# Altium schematic sheet interface.SchDoc: Interface
size A3; Author: Francesco Sacchi <batt@develer.com>; Organization: Develer s.r.l.; Address1: via Mugellese 1/A; Address2: 50019 Campi Bisenzio; Address3: Firenze; Address4: ITALY; DocumentNumber: 1; Revision: 0; SheetNumber: 1; SheetTotal: 6
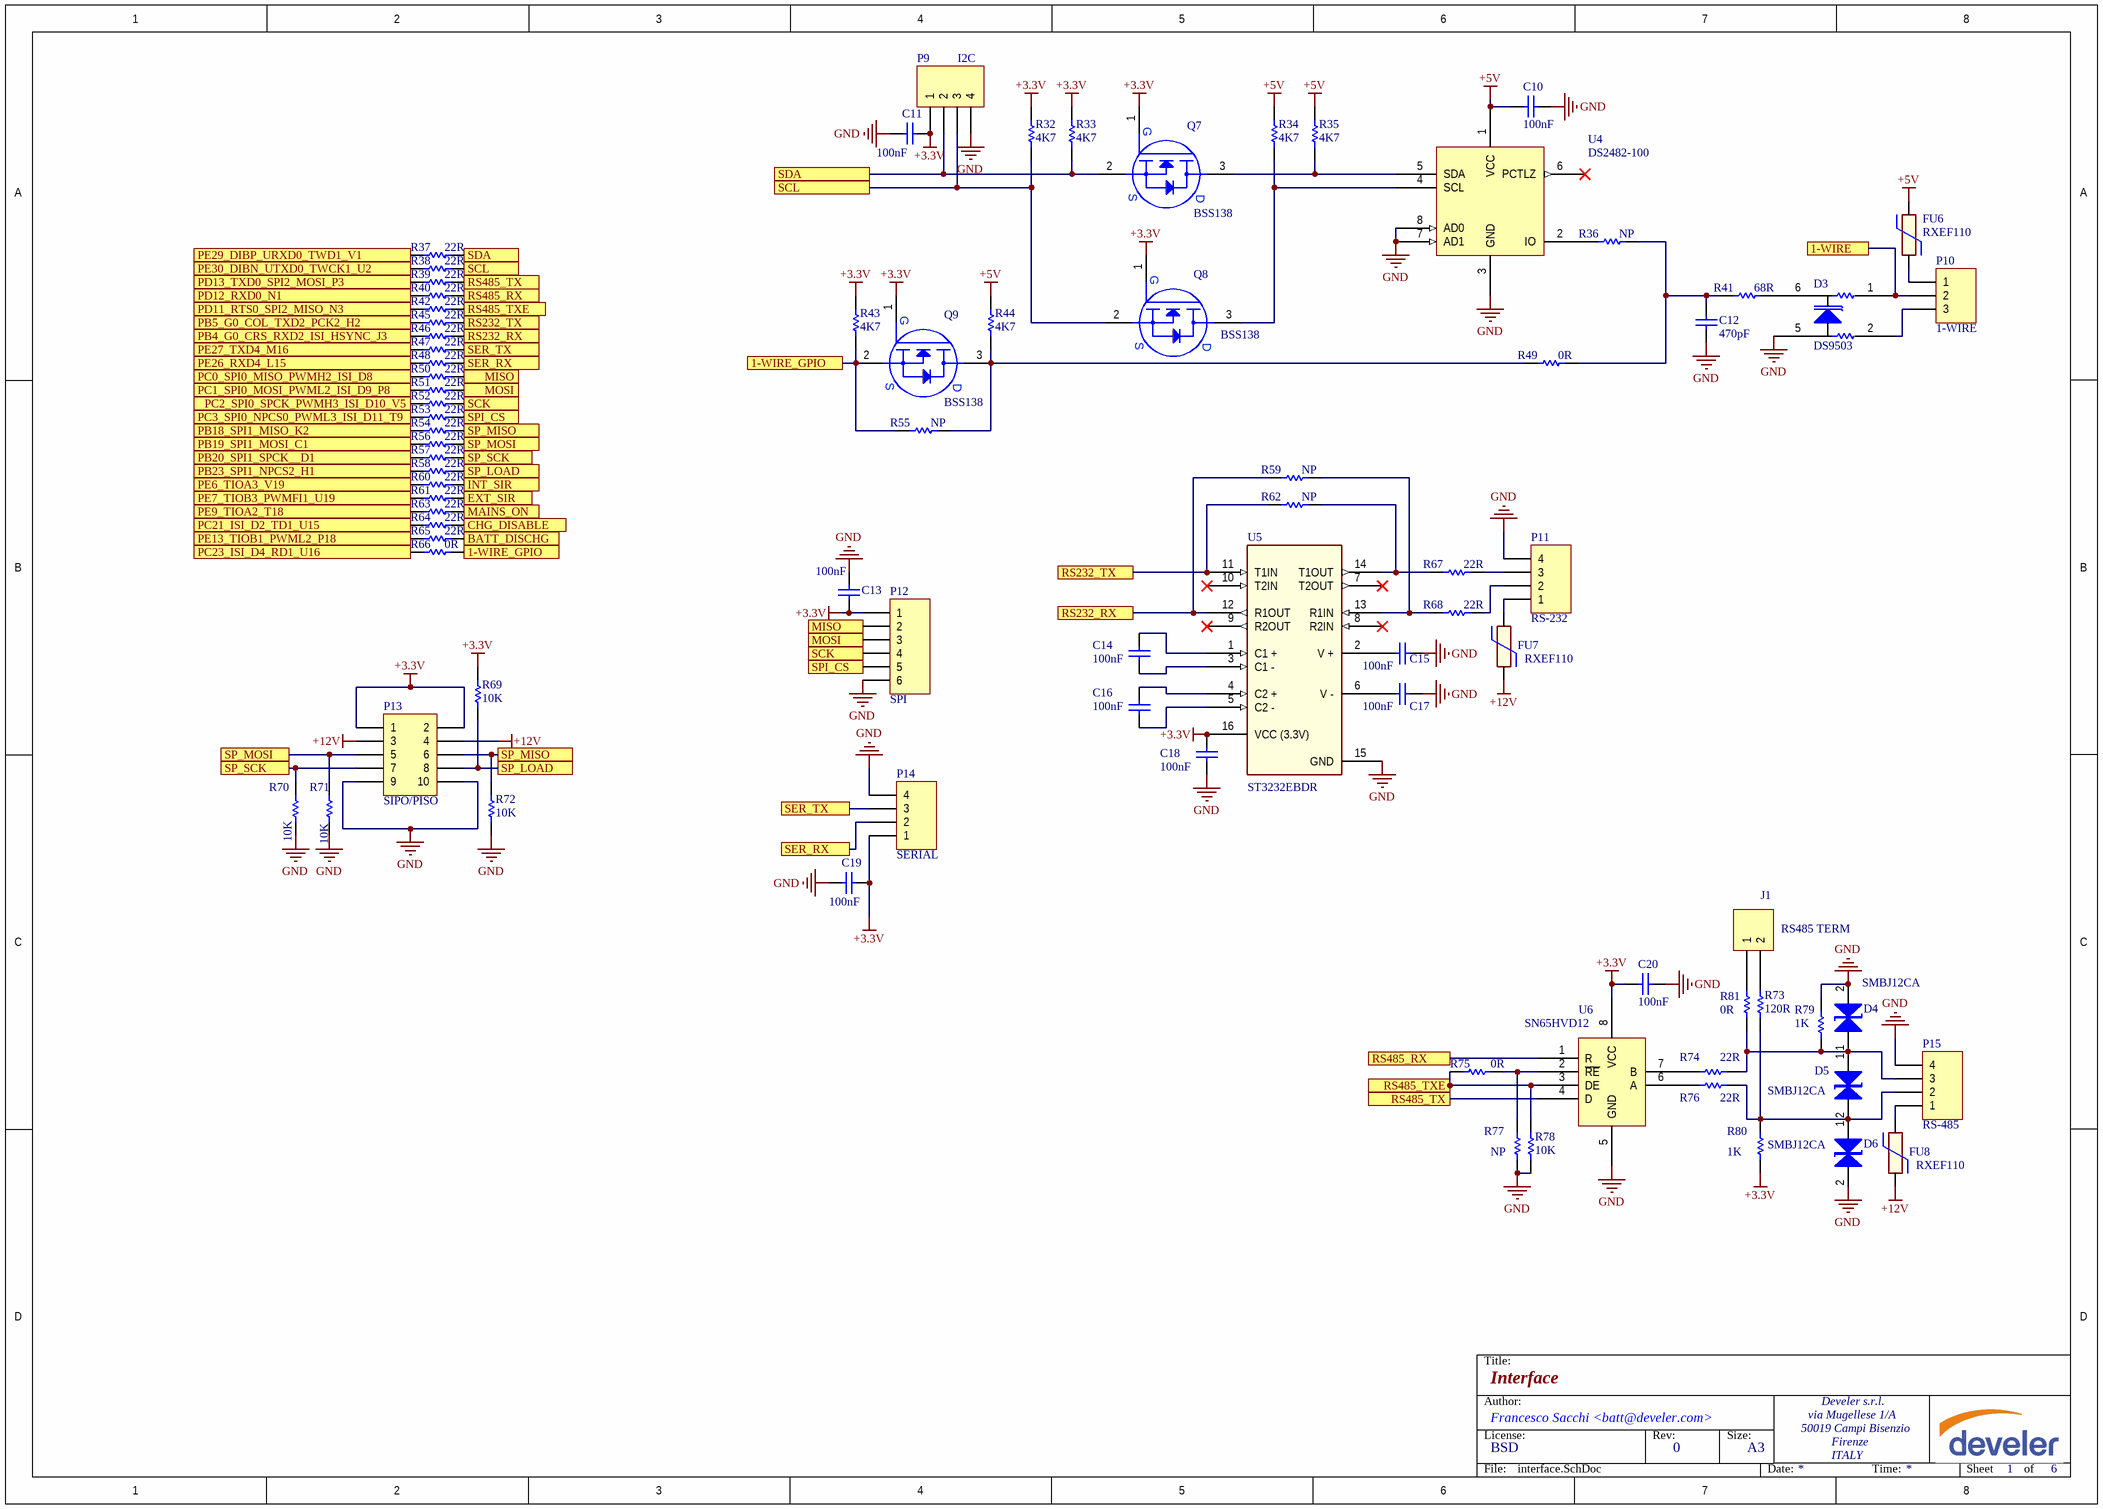
[diagram p0: interface.SchDoc]

## Parts
C10  100nF  [0603_[1608]]
C11  100nF  [0603_[1608]]
C12  470pF  [0603_[1608]]
C13  100nF  [0603_[1608]]
C14  100nF  [0603_[1608]]
C15  100nF  [0603_[1608]]
C16  100nF  [0603_[1608]]
C17  100nF  [0603_[1608]]
C18  100nF  [0603_[1608]]
C19  100nF  [0603_[1608]]
C20  100nF  [0603_[1608]]
D3  DS9503  [TSOC6]
D4  SMBJ12CA  [DO214AA_12]
D5  SMBJ12CA  [DO214AA_12]
D6  SMBJ12CA  [DO214AA_12]
FU6  RXEF110  [RADIAL_5.08mm_polyswitch]
FU7  RXEF110  [RADIAL_5.08mm_polyswitch]
FU8  RXEF110  [RADIAL_5.08mm_polyswitch]
J1  RS485 TERM  [HEADER_1X2_2.54MM_THD]
P9  I2C  [HEADER_1X4_2.54MM_THD]
P10  1-WIRE  [TBLOCK_1X3_3.5MM_HOR_THD]
P11  RS-232  [TBLOCK_1X4_3.5MM_HOR_THD]
P12  SPI  [HEADER_1X6_2.54MM_THD]
P13  SIPO/PISO  [HEADER_2X5_2.54MM_THD_BOXED]
P14  SERIAL  [HEADER_1X4_2.54MM_THD]
P15  RS-485  [TBLOCK_1X4_3.5MM_HOR_THD]
Q7  BSS138  [sot-23]
Q8  BSS138  [sot-23]
Q9  BSS138  [sot-23]
R32  4K7  [0603_[1608]]
R33  4K7  [0603_[1608]]
R34  4K7  [0603_[1608]]
R35  4K7  [0603_[1608]]
R36  NP  [0603_[1608]]
R37  22R  [0603_[1608]]
R38  22R  [0603_[1608]]
R39  22R  [0603_[1608]]
R40  22R  [0603_[1608]]
R41  68R  [0603_[1608]]
R42  22R  [0603_[1608]]
R43  4K7  [0603_[1608]]
R44  4K7  [0603_[1608]]
R45  22R  [0603_[1608]]
R46  22R  [0603_[1608]]
R47  22R  [0603_[1608]]
R48  22R  [0603_[1608]]
R49  0R  [0603_[1608]]
R50  22R  [0603_[1608]]
R51  22R  [0603_[1608]]
R52  22R  [0603_[1608]]
R53  22R  [0603_[1608]]
R54  22R  [0603_[1608]]
R55  NP  [0603_[1608]]
R56  22R  [0603_[1608]]
R57  22R  [0603_[1608]]
R58  22R  [0603_[1608]]
R59  NP  [0603_[1608]]
R60  22R  [0603_[1608]]
R61  22R  [0603_[1608]]
R62  NP  [0603_[1608]]
R63  22R  [0603_[1608]]
R64  22R  [0603_[1608]]
R65  22R  [0603_[1608]]
R66  0R  [0603_[1608]]
R67  22R  [0603_[1608]]
R68  22R  [0603_[1608]]
R69  10K  [0603_[1608]]
R70  10K  [0603_[1608]]
R71  10K  [0603_[1608]]
R72  10K  [0603_[1608]]
R73  120R  [0603_[1608]]
R74  22R  [0603_[1608]]
R75  0R  [0603_[1608]]
R76  22R  [0603_[1608]]
R77  NP  [0603_[1608]]
R78  10K  [0603_[1608]]
R79  1K  [0603_[1608]]
R80  1K  [0603_[1608]]
R81  0R  [0603_[1608]]
U4  DS2482-100  [SOIC8]
U5  ST3232EBDR  [SOIC16]
U6  SN65HVD12  [SOIC8]

## Ports
1-WIRE, 1-WIRE_GPIO, BATT_DISCHG, CHG_DISABLE, EXT_SIR, INT_SIR, MAINS_ON, MISO, MOSI, PB4_G0_CRS_RXD2_ISI_HSYNC_J3, PB5_G0_COL_TXD2_PCK2_H2, PB18_SPI1_MISO_K2, PB19_SPI1_MOSI_C1, PB20_SPI1_SPCK__D1, PB23_SPI1_NPCS2_H1, PC0_SPI0_MISO_PWMH2_ISI_D8, PC1_SPI0_MOSI_PWML2_ISI_D9_P8, PC2_SPI0_SPCK_PWMH3_ISI_D10_V5, PC3_SPI0_NPCS0_PWML3_ISI_D11_T9, PC21_ISI_D2_TD1_U15, PC23_ISI_D4_RD1_U16, PD11_RTS0_SPI2_MISO_N3, PD12_RXD0_N1, PD13_TXD0_SPI2_MOSI_P3, PE6_TIOA3_V19, PE7_TIOB3_PWMFI1_U19, PE9_TIOA2_T18, PE13_TIOB1_PWML2_P18, PE26_RXD4_L15, PE27_TXD4_M16, PE29_DIBP_URXD0_TWD1_V1, PE30_DIBN_UTXD0_TWCK1_U2, RS232_RX, RS232_TX, RS485_RX, RS485_TX, RS485_TXE, SCK, SCL, SDA, SER_RX, SER_TX, SP_LOAD, SP_MISO, SP_MOSI, SP_SCK, SPI_CS

## Nets
+3.3V: C11.2 C13.2 C18.2 C19.2 C20.2 P9.1 P12.1 P13.1 P13.2 P14.1 Q7.1(G) Q8.1(G) Q9.1(G) R32.2 R33.2 R43.2 R69.2 R80.1 U5.16(VCC_(3.3V)) U6.8(VCC)
+5V: C10.2 FU6.1 R34.2 R35.2 R44.2 U4.1(VCC)
+12V: FU7.1 FU8.1 P13.3 P13.4
GND: C10.1 C11.1 C12.2 C13.1 C15.1 C17.1 C18.1 C19.1 C20.1 D3.5 D4.2 D6.2 P9.4 P11.4 P12.6 P13.9 P13.10 P14.4 P15.4 R70.1 R71.1 R72.1 R77.1 R78.1 R79.2 U4.3(GND) U4.7(AD1) U4.8(AD0) U5.15(GND) U6.5(GND)
1-WIRE: D3.1 P10.2 ; port 1-WIRE
1-WIRE_GPIO: Q9.2(S) R43.1 R55.1 R66.2 ; port 1-WIRE_GPIO
BATT_DISCHG: R65.2 ; port BATT_DISCHG
CHG_DISABLE: R64.2 ; port CHG_DISABLE
EXT_SIR: R61.2 ; port EXT_SIR
INT_SIR: R60.2 ; port INT_SIR
MAINS_ON: R63.2 ; port MAINS_ON
MISO: P12.2 R50.2 ; port MISO
MOSI: P12.3 R51.2 ; port MOSI
PB4_G0_CRS_RXD2_ISI_HSYNC_J3: R46.1 ; port PB4_G0_CRS_RXD2_ISI_HSYNC_J3
PB5_G0_COL_TXD2_PCK2_H2: R45.1 ; port PB5_G0_COL_TXD2_PCK2_H2
PB18_SPI1_MISO_K2: R54.1 ; port PB18_SPI1_MISO_K2
PB19_SPI1_MOSI_C1: R56.1 ; port PB19_SPI1_MOSI_C1
PB20_SPI1_SPCK__D1: R57.1 ; port PB20_SPI1_SPCK__D1
PB23_SPI1_NPCS2_H1: R58.1 ; port PB23_SPI1_NPCS2_H1
PC0_SPI0_MISO_PWMH2_ISI_D8: R50.1 ; port PC0_SPI0_MISO_PWMH2_ISI_D8
PC1_SPI0_MOSI_PWML2_ISI_D9_P8: R51.1 ; port PC1_SPI0_MOSI_PWML2_ISI_D9_P8
PC2_SPI0_SPCK_PWMH3_ISI_D10_V5: R52.1 ; port PC2_SPI0_SPCK_PWMH3_ISI_D10_V5
PC3_SPI0_NPCS0_PWML3_ISI_D11_T9: R53.1 ; port PC3_SPI0_NPCS0_PWML3_ISI_D11_T9
PC21_ISI_D2_TD1_U15: R64.1 ; port PC21_ISI_D2_TD1_U15
PC23_ISI_D4_RD1_U16: R66.1 ; port PC23_ISI_D4_RD1_U16
PD11_RTS0_SPI2_MISO_N3: R42.1 ; port PD11_RTS0_SPI2_MISO_N3
PD12_RXD0_N1: R40.1 ; port PD12_RXD0_N1
PD13_TXD0_SPI2_MOSI_P3: R39.1 ; port PD13_TXD0_SPI2_MOSI_P3
PE6_TIOA3_V19: R60.1 ; port PE6_TIOA3_V19
PE7_TIOB3_PWMFI1_U19: R61.1 ; port PE7_TIOB3_PWMFI1_U19
PE9_TIOA2_T18: R63.1 ; port PE9_TIOA2_T18
PE13_TIOB1_PWML2_P18: R65.1 ; port PE13_TIOB1_PWML2_P18
PE26_RXD4_L15: R48.1 ; port PE26_RXD4_L15
PE27_TXD4_M16: R47.1 ; port PE27_TXD4_M16
PE29_DIBP_URXD0_TWD1_V1: R37.1 ; port PE29_DIBP_URXD0_TWD1_V1
PE30_DIBN_UTXD0_TWCK1_U2: R38.1 ; port PE30_DIBN_UTXD0_TWCK1_U2
RS232_RX: R46.2 R59.1 U5.12(R1OUT) ; port RS232_RX
RS232_TX: R45.2 R62.1 U5.11(T1IN) ; port RS232_TX
RS485_RX: R40.2 U6.1(R) ; port RS485_RX
RS485_TX: R39.2 U6.4(D) ; port RS485_TX
RS485_TXE: R42.2 R75.2 R78.2 U6.3(DE) ; port RS485_TXE
SCK: P12.4 R52.2 ; port SCK
SCL: P9.3 Q8.2(S) R32.1 R38.2 ; port SCL
SDA: P9.2 Q7.2(S) R33.1 R37.2 ; port SDA
SER_RX: P14.2 R48.2 ; port SER_RX
SER_TX: P14.3 R47.2 ; port SER_TX
SP_LOAD: P13.8 R58.2 R69.1 ; port SP_LOAD
SP_MISO: P13.6 R54.2 R72.2 ; port SP_MISO
SP_MOSI: P13.5 R56.2 R71.2 ; port SP_MOSI
SP_SCK: P13.7 R57.2 R70.2 ; port SP_SCK
SPI_CS: P12.5 R53.2 ; port SPI_CS
NetC12_1: C12.1 R36.2 R41.1 R49.2
NetC14_1: C14.1 U5.1(C1_+)
NetC14_2: C14.2 U5.3(C1_-)
NetC15_2: C15.2 U5.2(V_+)
NetC16_1: C16.1 U5.5(C2_-)
NetC16_2: C16.2 U5.4(C2_+)
NetC17_2: C17.2 U5.6(V_-)
NetD3_2: D3.2 P10.3
NetD3_6: D3.6 R41.2
NetD4_1: D4.1 D5.1 P15.3 R74.2 R79.1 R81.2
NetD5_2: D5.2 D6.1 P15.2 R73.2 R76.2 R80.2
NetFU6_2: FU6.2 P10.1
NetFU7_2: FU7.2 P11.1
NetFU8_2: FU8.2 P15.1
NetJ1_1: J1.1 R81.1
NetJ1_2: J1.2 R73.1
NetP11_2: P11.2 R68.2
NetP11_3: P11.3 R67.2
NetQ7_3: Q7.3(D) R35.1 U4.5(SDA)
NetQ8_3: Q8.3(D) R34.1 U4.4(SCL)
NetQ9_3: Q9.3(D) R44.1 R49.1 R55.2
NetR36_1: R36.1 U4.2(IO)
NetR59_2: R59.2 R68.1 U5.13(R1IN)
NetR62_2: R62.2 R67.1 U5.14(T1OUT)
NetR74_1: R74.1 U6.7(B)
NetR75_1: R75.1 R77.2 U6.2(~{RE})
NetR76_1: R76.1 U6.6(A)

Not connected (* = marked no-connect by the designer): U4 6(PCTLZ)*; U5 7(T2OUT)* 8(R2IN)* 9(R2OUT)* 10(T2IN)*

## Notes on the sheet
- Title:
- Author:
- License:
- BSD
- Rev:
- Size:
- A3
- File:
- Date:
- Time:
- Sheet
- of

## Library data of the parts
C10-C20 = Cap: Ceramic X7R 50V; Value: 100pF; Published: 8-Jun-2000; LatestRevisionDate: 17-Jul-2002; LatestRevisionNote: Re-released for DXP Platform.; PackageReference: RAD-0.3; Publisher: Altium Limited; PackageDescription: Radial Cap, Thru-Hole; 2 Leads; 0.3 in Pin Spacing
D3 = DS9503: ESD Protection Diode with Resistors
D4-D6 = TVS bi: TVS bidirectional
FU6-FU8 = FuseAutoReset: Fuse autoreset
J1 = Header 2: Pin Header, 2.54mm, 1x2, 2pin; LatestRevisionDate: 17-Jul-2002; LatestRevisionNote: Re-released for DXP Platform.; Publisher: Altium Limited
P9 P11 P14 P15 = Header 4: Header, 4-Pin; LatestRevisionDate: 17-Jul-2002; LatestRevisionNote: Re-released for DXP Platform.; Publisher: Altium Limited
P10 = Header 3: Header, 3-Pin; LatestRevisionDate: 17-Jul-2002; LatestRevisionNote: Re-released for DXP Platform.; Publisher: Altium Limited
P12 = Header 6: Header, 6-Pin; LatestRevisionDate: 17-Jul-2002; LatestRevisionNote: Re-released for DXP Platform.; Publisher: Altium Limited
P13 = Header 5X2: Header, 5-Pin, Dual row; LatestRevisionDate: 17-Jul-2002; LatestRevisionNote: Re-released for DXP Platform.; Publisher: Altium Limited
Q7-Q9 = MOSFET-N 3pin: N MOS
R32-R81 = Res1: Resistor; Revision: July-2002: Re-released for DXP Platform.
U4 = DS2482-100: Single-Channel 1-Wire Master
U5 = ST3232CDR: 3 to 5.5 V, low power, up to 400 kbps RS-232 driver; Part Number: STm ST3232CDR; Purchase Code: Digikey 497-3731-6-ND
U6 = SN65HVD12: 3.3V to RS485 interface